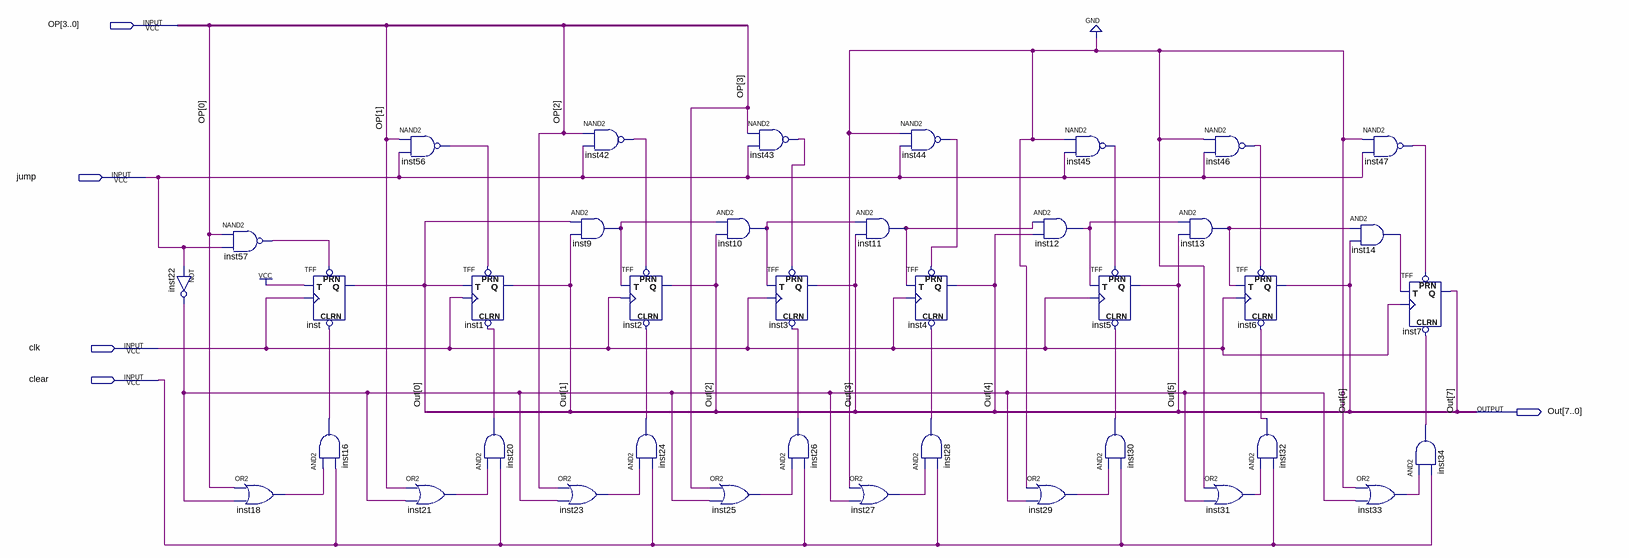
[diagram p0: schematic sheet]
// Quartus schematic Contador.bdf as structural Verilog: 39 symbols, 5 pins
module Contador (
  input  [3:0] OP,
  input  jump,
  input  clk,
  input  clear,
  output [7:0] Out
);

  wire inst9_out, inst10_out, inst11_out, inst12_out, inst13_out, inst14_out, inst16_out, inst18_out,
       inst20_out, inst21_out, inst22_out, inst23_out, inst24_out, inst25_out, inst26_out, inst27_out,
       inst28_out, inst29_out, inst30_out, inst31_out, inst32_out, inst33_out, inst34_out, inst42_out,
       inst43_out, inst44_out, inst45_out, inst46_out, inst47_out, inst56_out, inst57_out;

  not inst22 (inst22_out, jump);
  nand inst57 (inst57_out, OP[0], jump);
  or inst18 (inst18_out, OP[0], inst22_out);
  TFF inst (.PRN(inst57_out), .CLRN(inst16_out), .T(1'b1), .CLK(clk), .Q(Out[0]));
  and inst16 (inst16_out, inst18_out, clear);
  nand inst56 (inst56_out, OP[1], jump);
  or inst21 (inst21_out, OP[1], inst22_out);
  TFF inst1 (.PRN(inst56_out), .CLRN(inst20_out), .T(Out[0]), .CLK(clk), .Q(Out[1]));
  and inst20 (inst20_out, inst21_out, clear);
  nand inst42 (inst42_out, OP[2], jump);
  and inst9 (inst9_out, Out[0], Out[1]);
  or inst23 (inst23_out, OP[2], inst22_out);
  TFF inst2 (.PRN(inst42_out), .CLRN(inst24_out), .T(inst9_out), .CLK(clk), .Q(Out[2]));
  and inst24 (inst24_out, inst23_out, clear);
  nand inst43 (inst43_out, OP[3], jump);
  and inst10 (inst10_out, inst9_out, Out[2]);
  or inst25 (inst25_out, OP[3], inst22_out);
  TFF inst3 (.PRN(inst43_out), .CLRN(inst26_out), .T(inst10_out), .CLK(clk), .Q(Out[3]));
  and inst26 (inst26_out, inst25_out, clear);
  and inst11 (inst11_out, inst10_out, Out[3]);
  or inst27 (inst27_out, 1'b0, inst22_out);
  nand inst44 (inst44_out, 1'b0, jump);
  TFF inst4 (.PRN(inst44_out), .CLRN(inst28_out), .T(inst11_out), .CLK(clk), .Q(Out[4]));
  and inst28 (inst28_out, inst27_out, clear);
  and inst12 (inst12_out, inst11_out, Out[4]);
  or inst29 (inst29_out, 1'b0, inst22_out);
  nand inst45 (inst45_out, 1'b0, jump);
  TFF inst5 (.PRN(inst45_out), .CLRN(inst30_out), .T(inst12_out), .CLK(clk), .Q(Out[5]));
  and inst30 (inst30_out, inst29_out, clear);
  nand inst46 (inst46_out, 1'b0, jump);
  and inst13 (inst13_out, inst12_out, Out[5]);
  or inst31 (inst31_out, 1'b0, inst22_out);
  TFF inst6 (.PRN(inst46_out), .CLRN(inst32_out), .T(inst13_out), .CLK(clk), .Q(Out[6]));
  and inst32 (inst32_out, inst31_out, clear);
  nand inst47 (inst47_out, 1'b0, jump);
  and inst14 (inst14_out, inst13_out, Out[6]);
  or inst33 (inst33_out, 1'b0, inst22_out);
  TFF inst7 (.PRN(inst47_out), .CLRN(inst34_out), .T(inst14_out), .CLK(clk), .Q(Out[7]));
  and inst34 (inst34_out, inst33_out, clear);
endmodule
